# Altium schematic sheet 电源.SchDoc
size A4
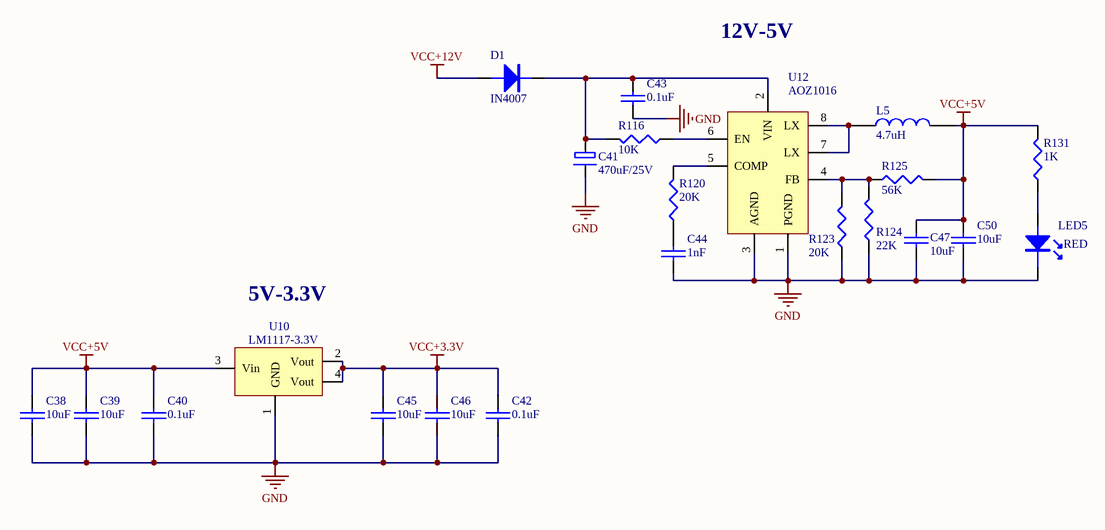
[diagram p0: 电源.SchDoc]

## Parts
C38  10uF  [0805]
C39  10uF  [0805]
C40  0.1uF  [0603]
C41  470uF/25V  [RB3.5]
C42  0.1uF  [0603]
C43  0.1uF  [0603]
C44  1nF  [0603]
C45  10uF  [0805]
C46  10uF  [0805]
C47  10uF  [0805]
C50  10uF  [0805]
D1  IN4007  [SMA(DO-214AC)]
L5  4.7uH  [INDUCTOR 7*7]
LED5  RED  [LED-0603]
R116  10K  [0603]
R120  20K  [0603]
R123  20K  [0603]
R124  22K  [0603]
R125  56K  [0603]
R131  1K  [0603]
U10  LM1117-3.3V  [SOT-223]
U12  AOZ1016  [SO-8]

## Nets
GND: C38.2 C39.2 C40.1 C41.2 C42.1 C43.1 C44.1 C45.2 C46.2 C47.1 C50.2 LED5.2 R123.1 R124.1 U10.1(GND) U12.1(PGND) U12.3(AGND)
VCC+3.3V: C42.2 C45.1 C46.1 U10.2(Vout) U10.4(Vout)
VCC+5V: C38.1 C39.1 C40.2 C47.2 C50.1 L5.2 R125.2 R131.2 U10.3(Vin)
VCC+12V: D1.1(A)
NetC41_1: C41.1 C43.2 D1.2(K) R116.2 U12.2(VIN)
NetC44_2: C44.2 R120.1
NetL5_1: L5.1 U12.7(LX) U12.8(LX)
NetLED5_1: LED5.1 R131.1
NetR116_1: R116.1 U12.6(EN)
NetR120_2: R120.2 U12.5(COMP)
NetR123_2: R123.2 R124.2 R125.1 U12.4(FB)

## Notes on the sheet
- 12V-5V
- 5V-3.3V

## Library data of the parts
C38 C39 C45-C47 C50 = CAP-0805: 0805陶瓷贴片电容
C40 C42-C44 = CAP-0603: 0603陶瓷贴片电容
C41 = 470uF/25V: 470uF/25V电解电容
D1 = IN4007: 整流二极管
L5 = INDUCTOR
LED5 = LED-0603: LED贴片发光二极管0603封装
R116 R120 R123-R125 R131 = RES-0603: 陶瓷贴片电阻0603封装
U12 = AOZ1016: DC-DC降压电源管理芯片